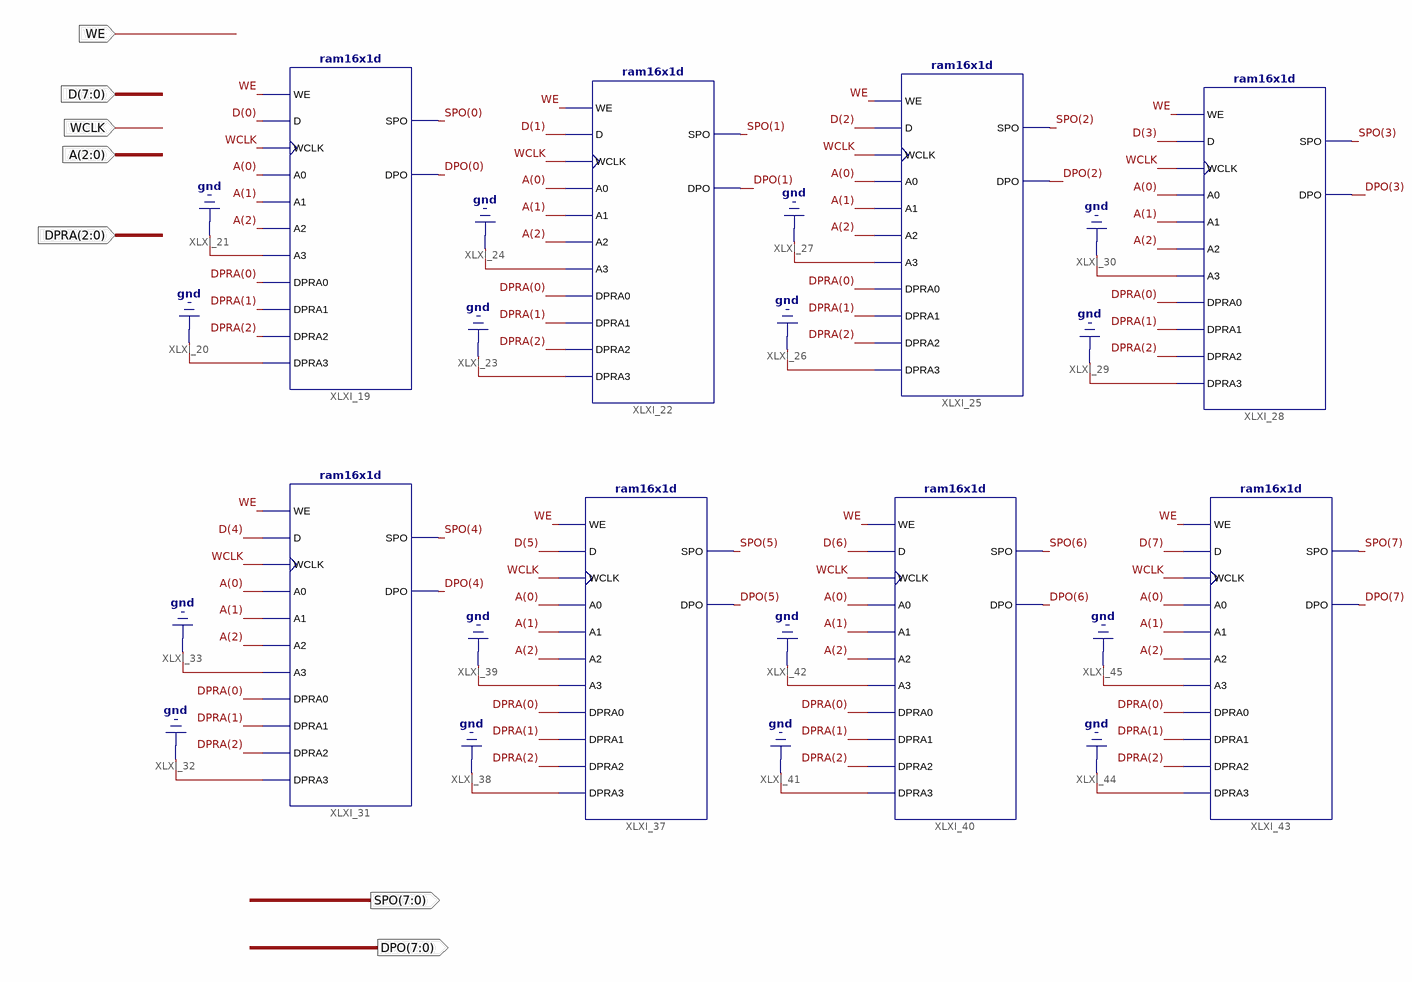
[diagram p0: schematic sheet 1]
// Xilinx ISE schematic RAM16X8D_n.sch (spartan6) as structural Verilog: 8 symbols, 7 ports
module RAM16X8D_n (
  input  WE,
  input  [7:0] D,
  input  WCLK,
  input  [2:0] A,
  input  [2:0] DPRA,
  output [7:0] SPO,
  output [7:0] DPO
);

  ram16x1d XLXI_19 (
    .A0(A[0]), .A1(A[1]), .A2(A[2]), .A3(1'b0), .D(D[0]), .DPRA0(DPRA[0]), .DPRA1(DPRA[1]), .DPRA2(DPRA[2]),
    .DPRA3(1'b0), .WCLK(WCLK), .WE(WE), .DPO(DPO[0]), .SPO(SPO[0]));
  ram16x1d XLXI_22 (
    .A0(A[0]), .A1(A[1]), .A2(A[2]), .A3(1'b0), .D(D[1]), .DPRA0(DPRA[0]), .DPRA1(DPRA[1]), .DPRA2(DPRA[2]),
    .DPRA3(1'b0), .WCLK(WCLK), .WE(WE), .DPO(DPO[1]), .SPO(SPO[1]));
  ram16x1d XLXI_25 (
    .A0(A[0]), .A1(A[1]), .A2(A[2]), .A3(1'b0), .D(D[2]), .DPRA0(DPRA[0]), .DPRA1(DPRA[1]), .DPRA2(DPRA[2]),
    .DPRA3(1'b0), .WCLK(WCLK), .WE(WE), .DPO(DPO[2]), .SPO(SPO[2]));
  ram16x1d XLXI_28 (
    .A0(A[0]), .A1(A[1]), .A2(A[2]), .A3(1'b0), .D(D[3]), .DPRA0(DPRA[0]), .DPRA1(DPRA[1]), .DPRA2(DPRA[2]),
    .DPRA3(1'b0), .WCLK(WCLK), .WE(WE), .DPO(DPO[3]), .SPO(SPO[3]));
  ram16x1d XLXI_31 (
    .A0(A[0]), .A1(A[1]), .A2(A[2]), .A3(1'b0), .D(D[4]), .DPRA0(DPRA[0]), .DPRA1(DPRA[1]), .DPRA2(DPRA[2]),
    .DPRA3(1'b0), .WCLK(WCLK), .WE(WE), .DPO(DPO[4]), .SPO(SPO[4]));
  ram16x1d XLXI_37 (
    .A0(A[0]), .A1(A[1]), .A2(A[2]), .A3(1'b0), .D(D[5]), .DPRA0(DPRA[0]), .DPRA1(DPRA[1]), .DPRA2(DPRA[2]),
    .DPRA3(1'b0), .WCLK(WCLK), .WE(WE), .DPO(DPO[5]), .SPO(SPO[5]));
  ram16x1d XLXI_40 (
    .A0(A[0]), .A1(A[1]), .A2(A[2]), .A3(1'b0), .D(D[6]), .DPRA0(DPRA[0]), .DPRA1(DPRA[1]), .DPRA2(DPRA[2]),
    .DPRA3(1'b0), .WCLK(WCLK), .WE(WE), .DPO(DPO[6]), .SPO(SPO[6]));
  ram16x1d XLXI_43 (
    .A0(A[0]), .A1(A[1]), .A2(A[2]), .A3(1'b0), .D(D[7]), .DPRA0(DPRA[0]), .DPRA1(DPRA[1]), .DPRA2(DPRA[2]),
    .DPRA3(1'b0), .WCLK(WCLK), .WE(WE), .DPO(DPO[7]), .SPO(SPO[7]));
endmodule
